# Altium schematic sheet Overview.SchDoc
size A; SheetNumber: 1; SheetTotal: 4
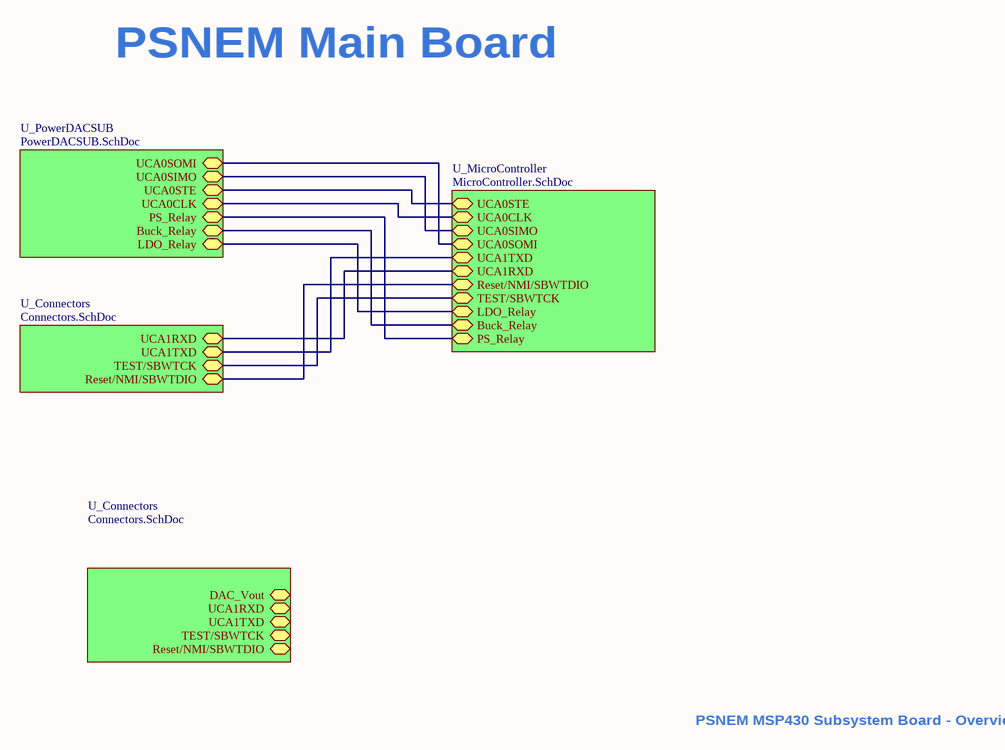
[diagram p0: Overview.SchDoc]

## Sub-sheets
U_Connectors = Connectors.SchDoc: Reset/NMI/SBWTDIO (bidir), TEST/SBWTCK (bidir), UCA1TXD (bidir), UCA1RXD (bidir)
U_Connectors = Connectors.SchDoc: Reset/NMI/SBWTDIO (bidir), TEST/SBWTCK (bidir), UCA1TXD (bidir), UCA1RXD (bidir), DAC_Vout (bidir)
U_MicroController = MicroController.SchDoc: UCA0STE (bidir), UCA0CLK (bidir), UCA0SIMO (bidir), UCA0SOMI (bidir), UCA1TXD (bidir), UCA1RXD (bidir), Reset/NMI/SBWTDIO (bidir), TEST/SBWTCK (bidir), LDO_Relay (bidir), Buck_Relay (bidir), PS_Relay (bidir)
U_PowerDACSUB = PowerDACSUB.SchDoc: LDO_Relay (bidir), Buck_Relay (bidir), PS_Relay (bidir), UCA0CLK (bidir), UCA0STE (bidir), UCA0SIMO (bidir), UCA0SOMI (bidir)

## Nets
(unnamed): sheet U_Connectors/Reset/NMI/SBWTDIO, sheet U_MicroController/Reset/NMI/SBWTDIO
(unnamed): sheet U_Connectors/TEST/SBWTCK, sheet U_MicroController/TEST/SBWTCK
(unnamed): sheet U_Connectors/UCA1TXD, sheet U_MicroController/UCA1TXD
(unnamed): sheet U_Connectors/UCA1RXD, sheet U_MicroController/UCA1RXD
(unnamed): sheet U_MicroController/UCA0STE, sheet U_PowerDACSUB/UCA0STE
(unnamed): sheet U_MicroController/UCA0CLK, sheet U_PowerDACSUB/UCA0CLK
(unnamed): sheet U_MicroController/UCA0SIMO, sheet U_PowerDACSUB/UCA0SIMO
(unnamed): sheet U_MicroController/UCA0SOMI, sheet U_PowerDACSUB/UCA0SOMI
(unnamed): sheet U_MicroController/LDO_Relay, sheet U_PowerDACSUB/LDO_Relay
(unnamed): sheet U_MicroController/Buck_Relay, sheet U_PowerDACSUB/Buck_Relay
(unnamed): sheet U_MicroController/PS_Relay, sheet U_PowerDACSUB/PS_Relay

## Notes on the sheet
- PSNEM Main Board
- PSNEM MSP430 Subsystem Board - Overview